# EasyEDA schematic SCH_Syntheseproject2.0_2022-10-21.json
TITLE: Sheet_1; REV: 1.0; Date: 2022-10-14; Sheet: 1/1; Drawn By: roova; Company: Your Company
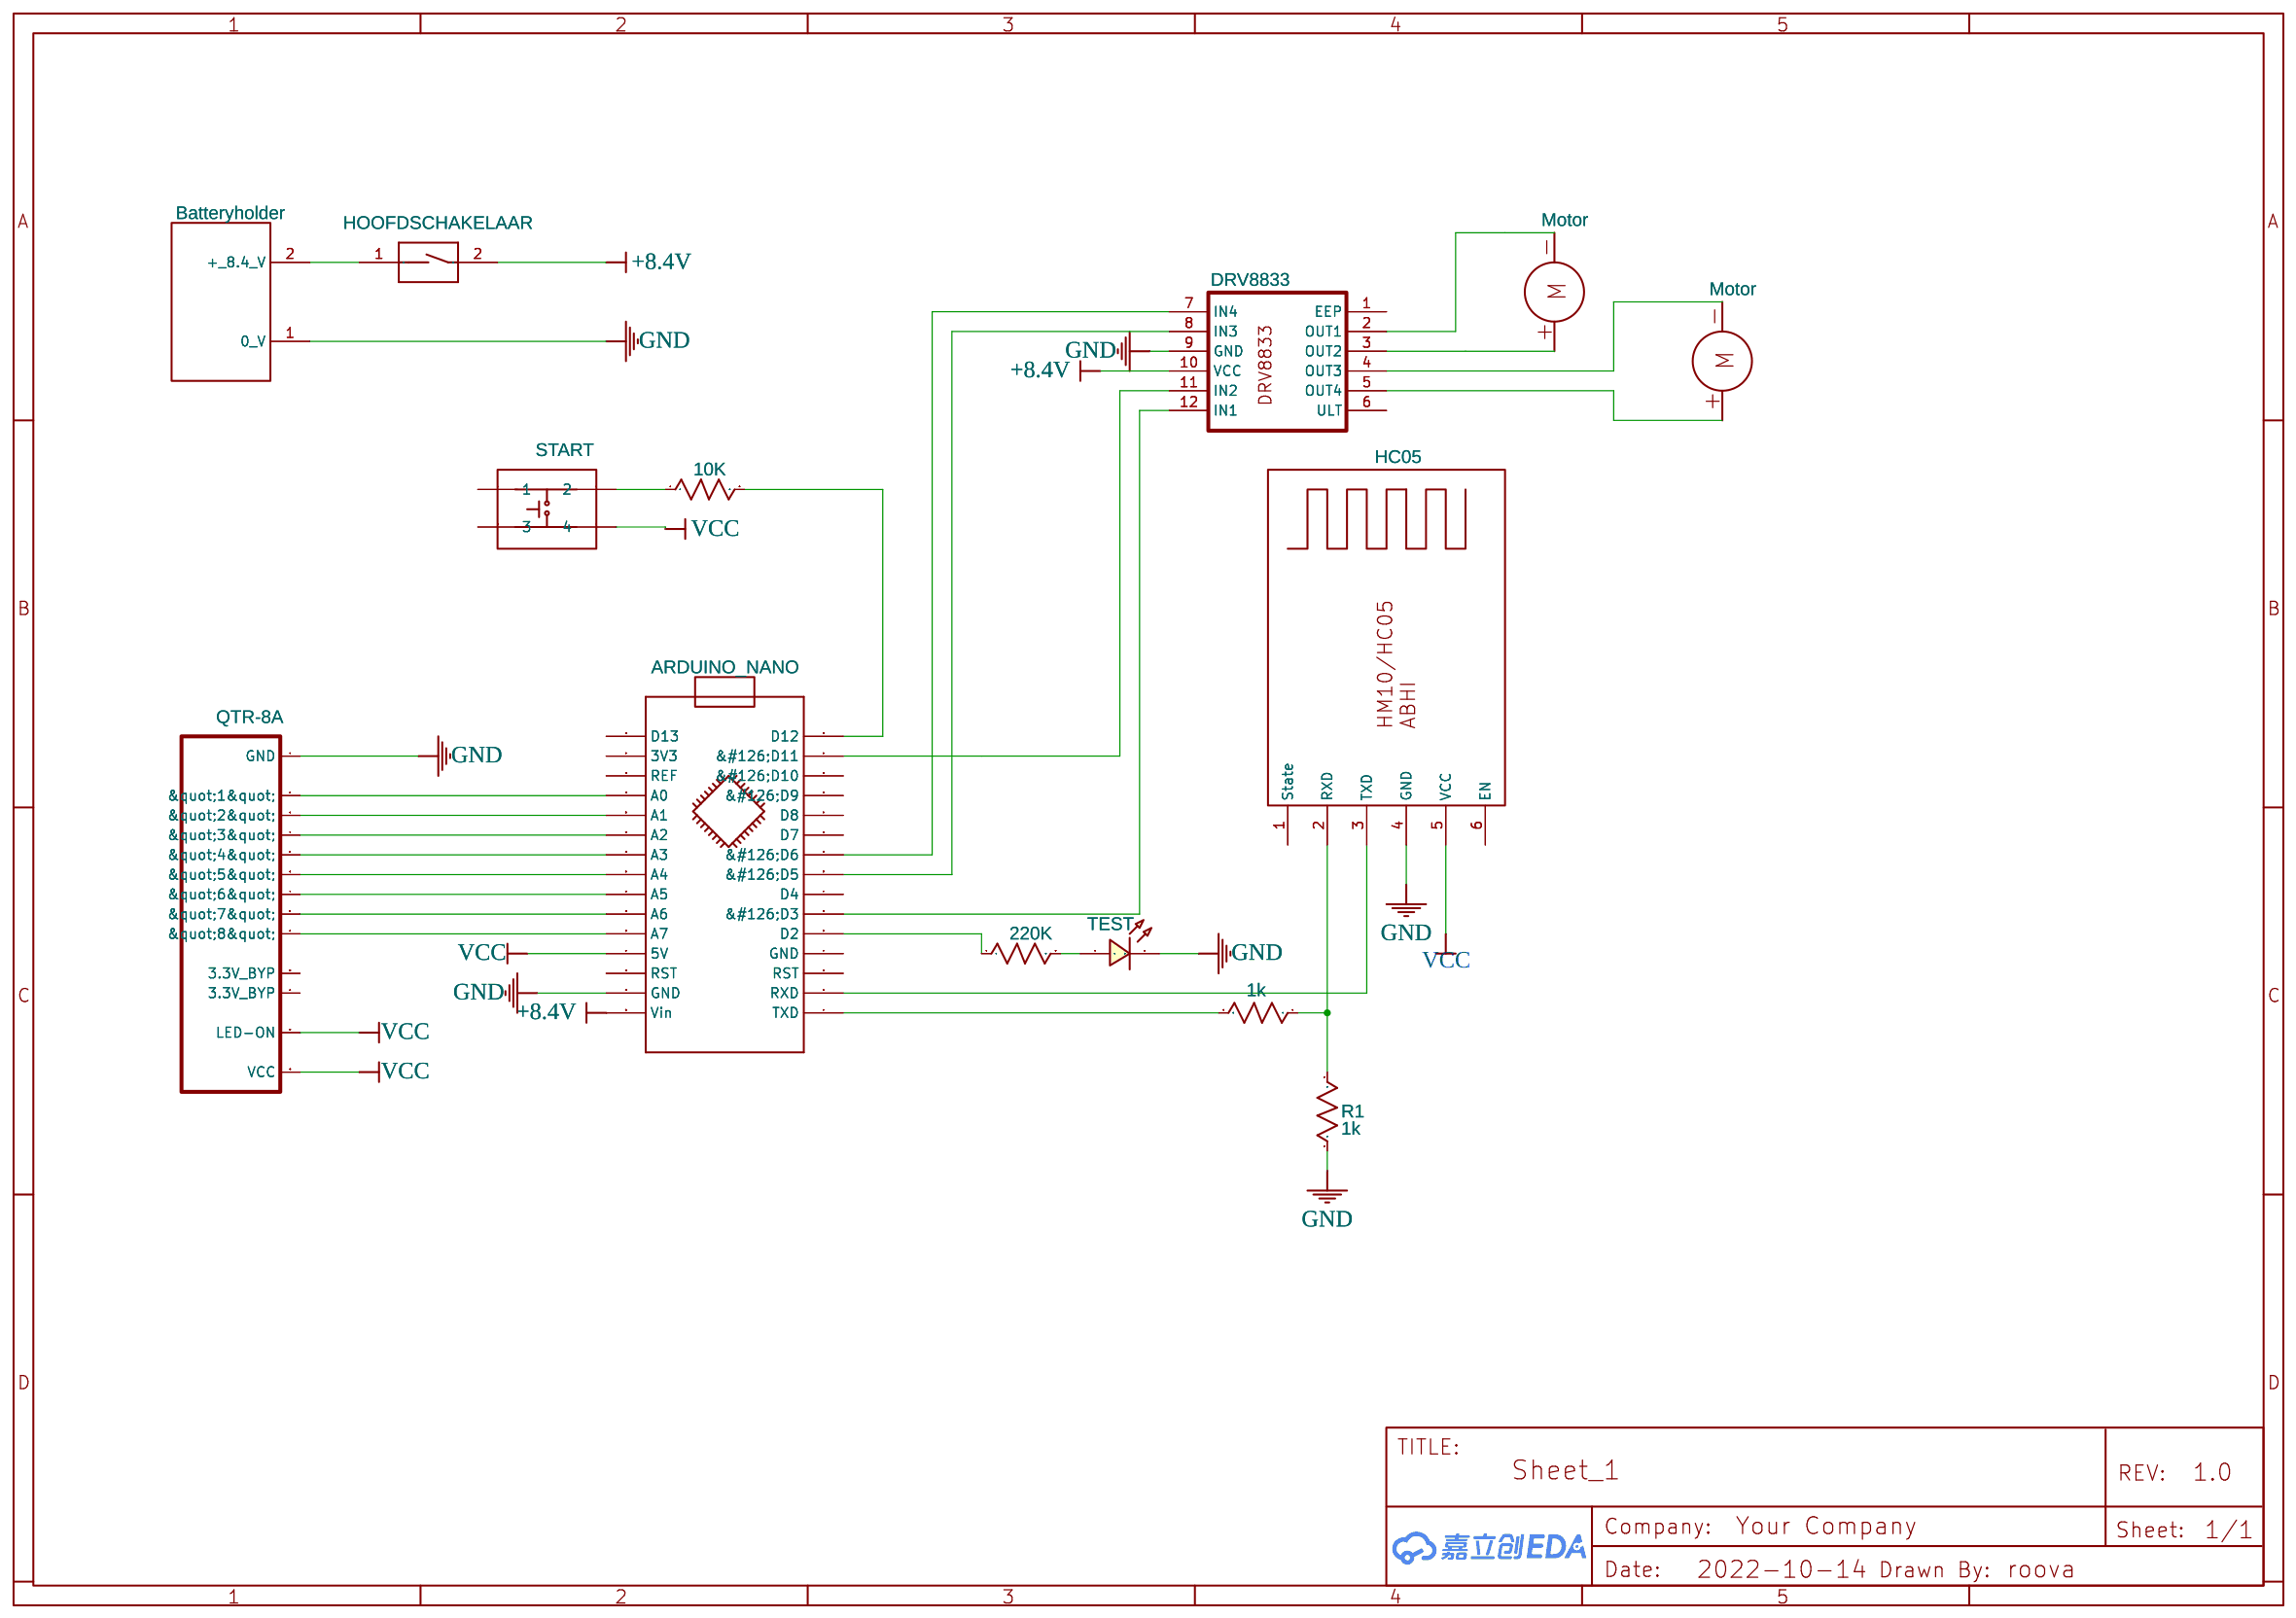
[diagram p0: schematic sheet]

## Parts
10K  1k  [R0603]
220K  1k  [R0603]
ARDUINO_NANO  ARDUINO-NANO_V3  [ARDUINO-NANO_AK]
HOOFDSCHAKELAAR  DIP1  [DIP SWITCH DIP1]
M2  Motor  [MOTOR]
M3  Motor  [MOTOR]
R1  1k  [R0603]
R2  1k  [R0603]
START  PUSHBUTTON 6X6X4.5 4 PINS COPY  [PUSH_BUTTON_4_PIN]
TEST  LED-0603_R  [LED0603_RED]
U1  DRV8833  [DRV8833 (NO ORIGINAL)]
U2  QTR-8A  [QTR-8A/8RC]
U3  HC05  [HM-10/HC-05-PCB-ABHI]
U4  Batteryholder  [BATTERYHOLDER_FP]

## Library data of the parts
10K 220K R1 R2 = R_0603_US: Contributor: LCEDA_Lib
ARDUINO_NANO = ARDUINO-NANO_V3: Contributor: madhunm
HOOFDSCHAKELAAR = DIP1: Supplier: Digi-Key; Manufacturer: Omron Electronics Inc-EMC Div; Manufacturer Part: A6TN-1101; Supplier Part: Z12167-ND
M2 M3 = Motor: Contributor: DiegoAlx
START = PUSHBUTTON 6X6X4.5 4 PINS COPY: Manufacturer: sparkfun; Manufacturer Part: sparkfun; Contributor: Jesus Rosales
TEST = LED-0603_R: Manufacturer: EVERLIGHT(台湾亿光); Manufacturer Part: 19-217/R6C-AL1M2VY/3T; Supplier Part: C72044; Supplier: LCSC; Contributor: LCEDA_01
U1 = DRV8833 (NO ORIGINAL): Contributor: PiterSantaCruz
U2 = QTR-8A: Manufacturer: Pololu; Supplier: Pololu; Supplier Part: 960; link: https://www.pololu.com/docs/pdf/0J12/QTR-8x.pdf; Contributor: Junikos
U3 = HC05/HM10-Abhi: Contributor: undefined.abhinav19
U4 = Batteryholder: Contributor: Foxl84

## Nets
+8.4V: ARDUINO_NANO.30(Vin) HOOFDSCHAKELAAR.2 U1.10(VCC)
GND: ARDUINO_NANO.29(GND) R1.1 TEST.2 U1.9(GND) U2.1(GND) U3.4(GND) U4.1(0 V)
VCC: ARDUINO_NANO.27(5V) START.4 U2.12(LED-ON) U3.5(VCC)
Net-(10K-1): 10K.1 START.2
Net-(10K-2): 10K.2 ARDUINO_NANO.15(D12)
Net-(220K-1): 220K.1 ARDUINO_NANO.5(D2)
Net-(220K-2): 220K.2 TEST.1
Net-(ARDUINO_NANO-1): ARDUINO_NANO.1(TXD) R2.2
Net-(ARDUINO_NANO-2): ARDUINO_NANO.2(RXD) U3.3(TXD)
Net-(ARDUINO_NANO-6): ARDUINO_NANO.6(&#126;D3) U1.12(IN1)
Net-(ARDUINO_NANO-8): ARDUINO_NANO.8(&#126;D5) U1.8(IN3)
Net-(ARDUINO_NANO-9): ARDUINO_NANO.9(&#126;D6) U1.7(IN4)
Net-(ARDUINO_NANO-14): ARDUINO_NANO.14(&#126;D11) U1.11(IN2)
Net-(ARDUINO_NANO-19): ARDUINO_NANO.19(A0) U2.2("1")
Net-(ARDUINO_NANO-20): ARDUINO_NANO.20(A1) U2.3("2")
Net-(ARDUINO_NANO-21): ARDUINO_NANO.21(A2) U2.4("3")
Net-(ARDUINO_NANO-22): ARDUINO_NANO.22(A3) U2.5("4")
Net-(ARDUINO_NANO-23): ARDUINO_NANO.23(A4) U2.6("5")
Net-(ARDUINO_NANO-24): ARDUINO_NANO.24(A5) U2.7("6")
Net-(ARDUINO_NANO-25): ARDUINO_NANO.25(A6) U2.8("7")
Net-(ARDUINO_NANO-26): ARDUINO_NANO.26(A7) U2.9("8")
Net-(HOOFDSCHAKELAAR-1): HOOFDSCHAKELAAR.1 U4.2(+ 8.4 V)
Net-(R1-2): R1.2 R2.1 U3.2(RXD)

Not connected (* = marked no-connect by the designer): ARDUINO_NANO 3(RST) 4(GND) 7(D4) 10(D7) 11(D8) 12(&#126;D9) 13(&#126;D10) 16(D13) 17(3V3) 18(REF) 28(RST); START 1 3; U1 1(EEP) 2(OUT1) 3(OUT2) 4(OUT3) 5(OUT4) 6(ULT); U2 10(3.3V BYP) 11(3.3V BYP); U3 1(State) 6(EN)
